# EAGLE design M0plus_breakout (EAGLE 7.7.0)
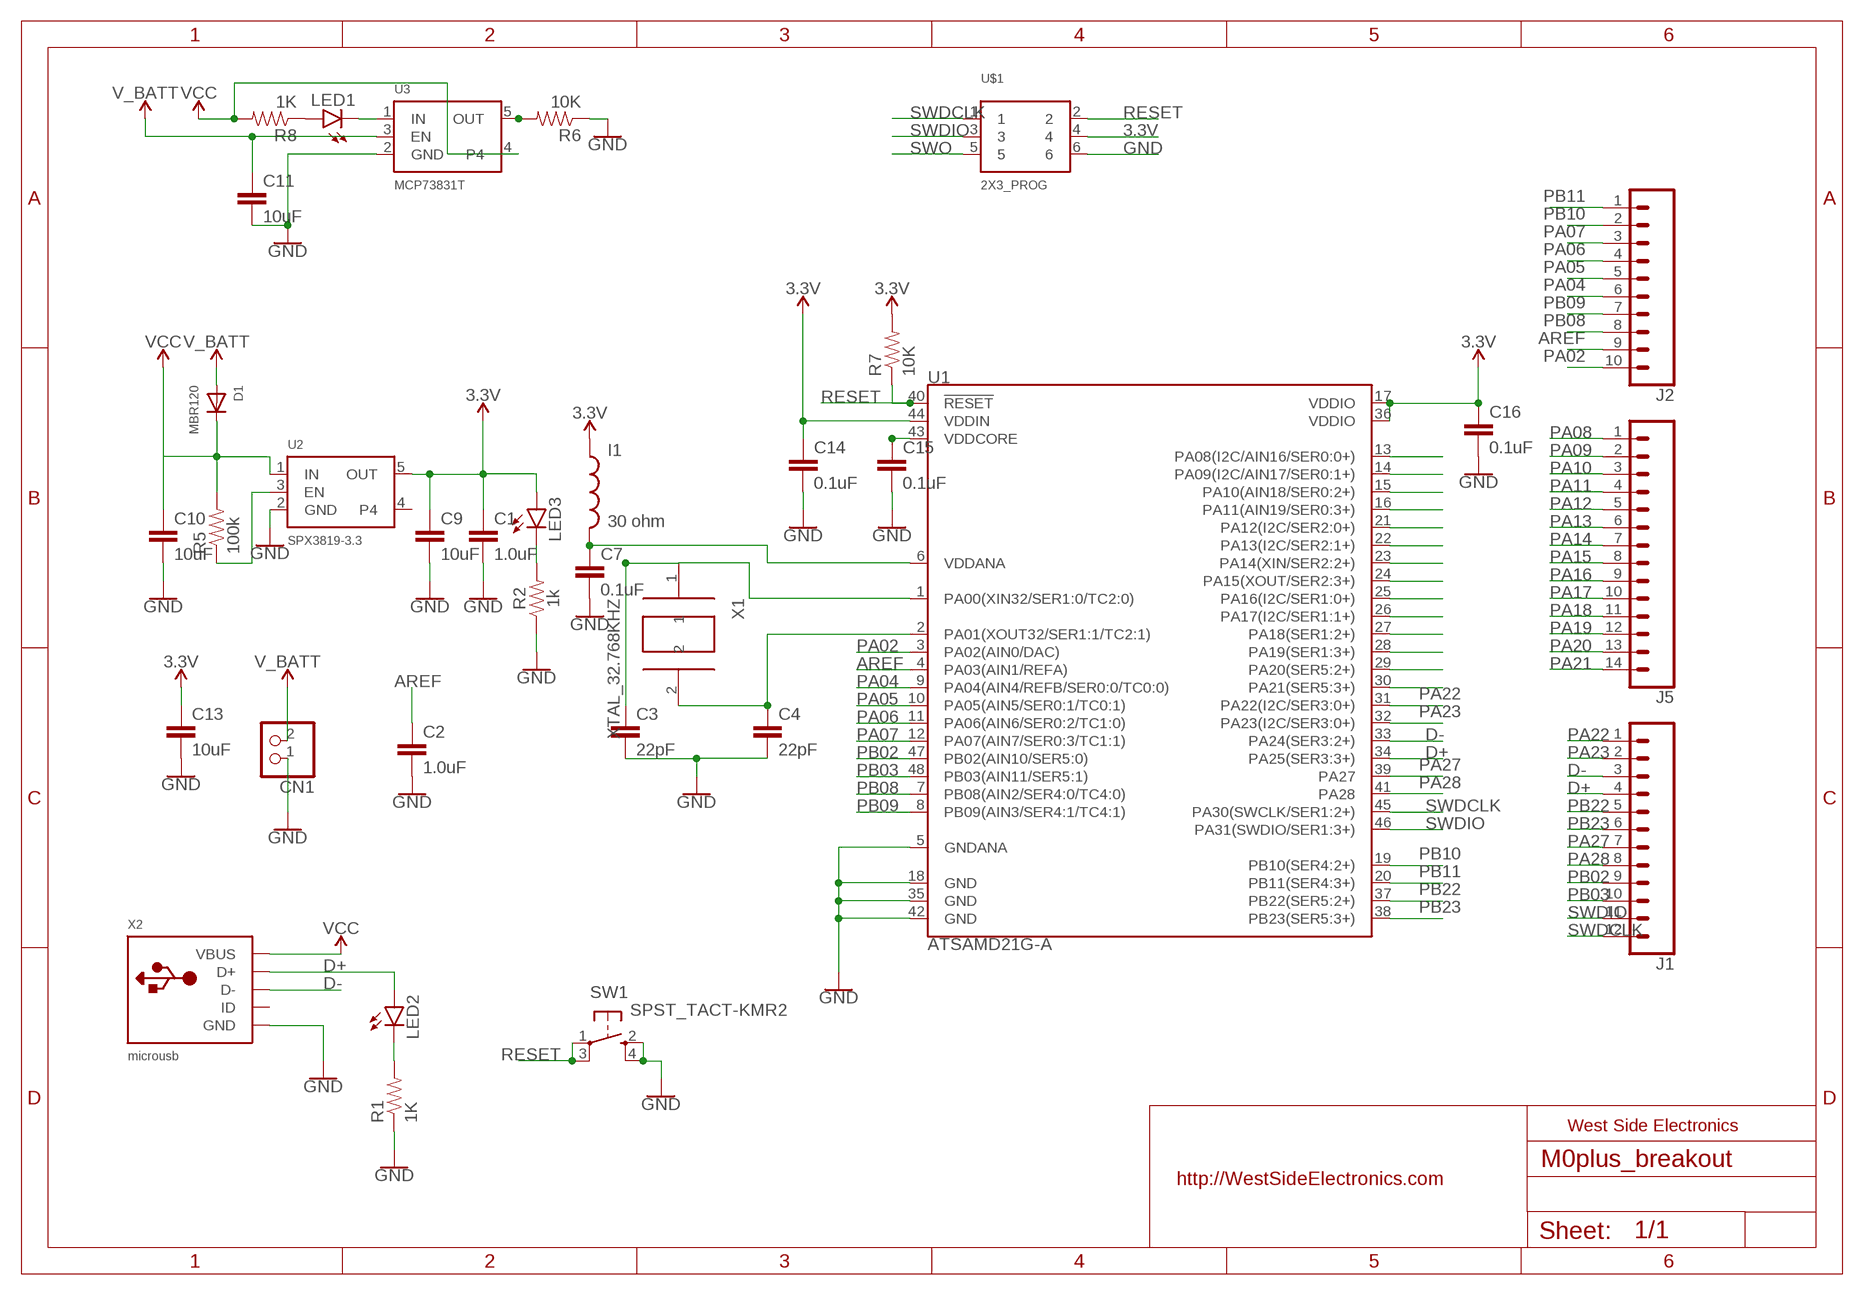
[diagram p0: schematic, sheet 1]

## Parts
C1  1.0uF  1.0UF-16V-10%(0603)  [0603-CAP]
C2  1.0uF  1.0UF-16V-10%(0603)  [0603-CAP]
C3  22pF  22PF-50V-5%(0603)  [0603-CAP]
C4  22pF  22PF-50V-5%(0603)  [0603-CAP]
C7  0.1uF  CAP  [0805]
C9  10uF  CAP  [0805]
C10  10uF  CAP  [0805]
C11  10uF  CAP  [0805]
C13  10uF  CAP  [0805]
C14  0.1uF  0.1UF-25V-5%(0603)  [0603-CAP]
C15  0.1uF  0.1UF-25V-5%(0603)  [0603-CAP]
C16  0.1uF  0.1UF-25V-5%(0603)  [0603-CAP]
CN1  JST_2PIN  [JSTPH2]
D1  MBR120  DIODESOD-123  [SOD-123]
I1  30 ohm  IND  [0805]
J1  CONN_12  [1X12]
J2  CONN_10"  [1X10]
J5  CONN_14  [1X14]
LED1  LED0603  [LED-0603]
LED2  LED0603  [LED-0603]
LED3  LED0603  [LED-0603]
R1  1K  1KOHM-1/10W-1%(0603)  [0603-RES]
R2  1k  1KOHM-0603-1/10W-1%  [0603]
R5  100k  100KOHM-1/10W-1%(0603)  [0603-RES]
R6  10K  10KOHM-1/10W-1%(0603)0603  [0603-RES]
R7  10K  10KOHM-1/10W-1%(0603)0603  [0603-RES]
R8  1K  1KOHM-1/10W-1%(0603)  [0603-RES]
SW1  SPST_TACT-KMR2  [KMR2]
U1  ATSAMD21G-A  [TQFP-48]
U2  SPX3819-3.3  VREG_SOT23-5  [SOT23-5]
U3  MCP73831T  VREG_SOT23-5  [SOT23-5]
U$1  2X3_PROG  [2X3-SMD_PROG]
X1  XTAL_32.768KHZ  [ABS07-32.768KHZ-9-T]
X2  microusb  USB_MICRO_20329_V2  [4UCONN_20329_V2]

## Nets
3.3V: C1.1 C9.1 C13.1 C14.1 C16.1 I1.1 LED3.A R7.2 U1.17(VDDIO) U1.36(VDDIO) U1.44(VDDIN) U2.5(OUT) U$1.4
AREF: C2.1 J2.9 U1.4(PA03(AIN1/REFA))
D+: J1.4 LED2.A U1.34(PA25(SER3:3+)) X2.D+
D-: J1.3 U1.33(PA24(SER3:2+)) X2.D-
GND: C1.2 C2.2 C3.2 C4.2 C7.2 C9.2 C10.2 C11.2 C13.2 C14.2 C15.2 C16.2 CN1.1 R1.1 R2.1 R6.1 SW1.2(S) SW1.4(S1) U1.5(GNDANA) U1.18(GND) U1.35(GND) U1.42(GND) U2.2(GND) U3.2(GND) U$1.6 X2.BASE@1(GND) X2.BASE@2(GND) X2.GND X2.SPRT@1(GND) X2.SPRT@2(GND) X2.SPRT@3(GND) X2.SPRT@4(GND)
N$1: LED1.A R8.1
N$2: C3.1 U1.1(PA00(XIN32/SER1:0/TC2:0)) X1.1
N$3: C4.1 U1.2(PA01(XOUT32/SER1:1/TC2:1)) X1.2
N$4: C15.1 U1.43(VDDCORE)
N$5: LED2.C R1.2
N$6: C7.1 I1.2 U1.6(VDDANA)
N$7: LED3.C R2.2
N$21: R5.1 U2.3(EN)
N$39: LED1.C U3.1(IN)
N$41: R6.2 U3.5(OUT)
PA02: J2.10 U1.3(PA02(AIN0/DAC))
PA04: J2.6 U1.9(PA04(AIN4/REFB/SER0:0/TC0:0))
PA05: J2.5 U1.10(PA05(AIN5/SER0:1/TC0:1))
PA06: J2.4 U1.11(PA06(AIN6/SER0:2/TC1:0))
PA07: J2.3 U1.12(PA07(AIN7/SER0:3/TC1:1))
PA08: J5.1 U1.13(PA08(I2C/AIN16/SER0:0+))
PA09: J5.2 U1.14(PA09(I2C/AIN17/SER0:1+))
PA10: J5.3 U1.15(PA10(AIN18/SER0:2+))
PA11: J5.4 U1.16(PA11(AIN19/SER0:3+))
PA12: J5.5 U1.21(PA12(I2C/SER2:0+))
PA13: J5.6 U1.22(PA13(I2C/SER2:1+))
PA14: J5.7 U1.23(PA14(XIN/SER2:2+))
PA15: J5.8 U1.24(PA15(XOUT/SER2:3+))
PA16: J5.9 U1.25(PA16(I2C/SER1:0+))
PA17: J5.10 U1.26(PA17(I2C/SER1:1+))
PA18: J5.11 U1.27(PA18(SER1:2+))
PA19: J5.12 U1.28(PA19(SER1:3+))
PA20: J5.13 U1.29(PA20(SER5:2+))
PA21: J5.14 U1.30(PA21(SER5:3+))
PA22: J1.1 U1.31(PA22(I2C/SER3:0+))
PA23: J1.2 U1.32(PA23(I2C/SER3:0+))
PA27: J1.7 U1.39(PA27)
PA28: J1.8 U1.41(PA28)
PB02: J1.9 U1.47(PB02(AIN10/SER5:0))
PB03: J1.10 U1.48(PB03(AIN11/SER5:1))
PB08: J2.8 U1.7(PB08(AIN2/SER4:0/TC4:0))
PB09: J2.7 U1.8(PB09(AIN3/SER4:1/TC4:1))
PB10: J2.2 U1.19(PB10(SER4:2+))
PB11: J2.1 U1.20(PB11(SER4:3+))
PB22: J1.5 U1.37(PB22(SER5:2+))
PB23: J1.6 U1.38(PB23(SER5:3+))
RESET: R7.1 SW1.1(P) SW1.3(P1) U1.40(!RESET!) U$1.2
SWDCLK: J1.12 U1.45(PA30(SWCLK/SER1:2+)) U$1.1
SWDIO: J1.11 U1.46(PA31(SWDIO/SER1:3+)) U$1.3
SWO: U$1.5
V_BATT: C11.1 CN1.2 D1.A U3.3(EN)
VCC: C10.1 D1.C R5.2 R8.2 U2.1(IN) U3.4 X2.VBUS
Unconnected: U2.4 X2.ID

## Library data of the parts
C1 C2 = SparkFun-Capacitors:1.0UF-16V-10%(0603): CAP-00868; PROD_ID: CAP-00868
C3 C4 = SparkFun-Capacitors:22PF-50V-5%(0603): CAP-07876; PROD_ID: CAP-07876
C7 C9-C11 C13 = Ilya_Teach:CAP
C14-C16 = SparkFun-Capacitors:0.1UF-25V-5%(0603): CAP-08604; PROD_ID: CAP-08604
CN1 = microbuilder:JST_2PIN: JST 2-Pin Right-Angle Connector PH-Series - 4UConnector: 17311 SH-Series - 4UConnector: 07278
D1 = microbuilder:DIODE: Diode SMA Model Volts Amps Type Vf Vr Digikey # Notes SSA34-E3 40V 3A Schottky 480mV @ 3A 200uA @ 40V SSA34-E3/61TGITR-ND CDBA120-G 20V 1A Schottky 500mV @ 1A 500uA @ 20V 641-1014-6-ND REEL MBRA210 10V 2A Schottky 350mV @ 2A 700uA @ 10V MBRA210LT3 SOD-123 Model Volts Amps Type Vf Vr Order # Notes BAT54T1G 30V 200mA Schottky 800mV @ 200mA 2uA @ 25V BAT54T1GOSTR-ND B0530W 30V 500mA Schottky 430mV @ 500mA 130uA @ 30V B0530W-FDICT-ND REEL MBR120 1A 20V Schottky 340mV @ 1A MBR120VLSFT1GOSCT-ND SOD-323 Model Volts Amps Type Vf Vr Order # Notes PMEG2005EJ 20V 500mA Schottky 355mV @ 500mA 568-4110-1-ND ZLLS410 10V 570mA Schottky 380mV @ 570mA ZLLS410CT-ND 1N4148WS 75V 150mA Silicon/Simple 1V 1N4148WSFSCT-ND REEL SOD-523 Model Volts Amps Type Vf Vr Order # Notes BAT54XV2 30V 200mA Schottky 0.8V @ 100mA BAT54XV2CT-ND TB751S 30V 30mA Schottky RB751S-40TE61CT-ND SOT23-R/W (R = Solder Paste/Reflow Ovens, W = Hand-Soldering) Model Volts Amps Type Vf Vr Order # Notes BAT54FILM 40V 300mA Schottky 497-7162-1-ND
I1 = Ilya_Teach:IND
J1 = SparkFun-Connectors:CONN_12: Multi connection point. Often used as Generic Header-pin footprint for 0.1 inch spaced/style header connections On any of the 0.1 inch spaced packages, you can populate with these: Break Away Headers - Straight <https://www.sparkfun.com/products/116> (PRT-00116) Break Away Male Headers - Right Angle <https://www.sparkfun.com/products/553> (PRT-00553) Female Headers <https://www.sparkfun.com/products/115> (PRT-00115) Break Away Headers - Machine Pin <https://www.sparkfun.com/products/117> (PRT-00117) Break Away Female Headers - Swiss Machine Pin <https://www.sparkfun.com/products/743> (PRT-00743) For SCREWTERMINALS and SPRING TERMINALS visit here: Screw Terimnals on SparkFun.com <https://www.sparkfun.com/search/results?term=Screw+Terminals> (5mm/3.5mm/2.54mm spacing) This device is also useful as a general connection point to wire up your design to another part of your project. Our various solder wires solder well into these plated through hole pads. Hook-Up Wire - Assortment (Stranded, 22 AWG) <https://www.sparkfun.com/products/11375> (PRT-11375) Hook-Up Wire - Assortment (Solid Core, 22 AWG) <https://www.sparkfun.com/products/11367> (PRT-11367) View the entire wire category on our website here <https://www.sparkfun.com/categories/141> Special notes: Molex polarized connector foot print use with SKU : PRT-08231 with associated crimp pins and housings. 1MM SMD Version SKU: PRT-10208 NOTES ON THE VARIANTS LOCK and LOCK_LONGPADS... This footprint was designed to help hold the alignment of a through-hole component (i.e. 6-pin header) while soldering it into place. You may notice that each hole has been shifted either up or down by 0.005 of an inch from it's more standard position (which is a perfectly straight line). This slight alteration caused the pins (the squares in the middle) to touch the edges of the holes. Because they are alternating, it causes a "brace" to hold the component in place. 0.005 has proven to be the perfect amount of "off-center" position when using our standard breakaway headers. Although looks a little odd when you look at the bare footprint, once you have a header in there, the alteration is very hard to notice. Also,if you push a header all the way into place, it is covered up entirely on the bottom side.
J2 = SparkFun-Connectors:CONN_10: Multi connection point. Often used as Generic Header-pin footprint for 0.1 inch spaced/style header connections On any of the 0.1 inch spaced packages, you can populate with these: Break Away Headers - Straight <https://www.sparkfun.com/products/116> (PRT-00116) Break Away Male Headers - Right Angle <https://www.sparkfun.com/products/553> (PRT-00553) Female Headers <https://www.sparkfun.com/products/115> (PRT-00115) Break Away Headers - Machine Pin <https://www.sparkfun.com/products/117> (PRT-00117) Break Away Female Headers - Swiss Machine Pin <https://www.sparkfun.com/products/743> (PRT-00743) Arduino Stackable Header - 10 Pin <https://www.sparkfun.com/products/11376> (PRT-11376) For SCREWTERMINALS and SPRING TERMINALS visit here: Screw Terimnals on SparkFun.com <https://www.sparkfun.com/search/results?term=Screw+Terminals> (5mm/3.5mm/2.54mm spacing) This device is also useful as a general connection point to wire up your design to another part of your project. Our various solder wires solder well into these plated through hole pads. Hook-Up Wire - Assortment (Stranded, 22 AWG) <https://www.sparkfun.com/products/11375> (PRT-11375) Hook-Up Wire - Assortment (Solid Core, 22 AWG) <https://www.sparkfun.com/products/11367> (PRT-11367) View the entire wire category on our website here <https://www.sparkfun.com/categories/141> Special notes: Molex polarized connector foot print use with SKU : PRT-08231 with associated crimp pins and housings. 1MM SMD Version SKU: PRT-10208 NOTES ON THE VARIANTS LOCK and LOCK_LONGPADS... This footprint was designed to help hold the alignment of a through-hole component (i.e. 6-pin header) while soldering it into place. You may notice that each hole has been shifted either up or down by 0.005 of an inch from it's more standard position (which is a perfectly straight line). This slight alteration caused the pins (the squares in the middle) to touch the edges of the holes. Because they are alternating, it causes a "brace" to hold the component in place. 0.005 has proven to be the perfect amount of "off-center" position when using our standard breakaway headers. Although looks a little odd when you look at the bare footprint, once you have a header in there, the alteration is very hard to notice. Also,if you push a header all the way into place, it is covered up entirely on the bottom side.; PROD_ID: CONN-11563
J5 = SparkFun-Connectors:CONN_14: Multi connection point. Often used as Generic Header-pin footprint for 0.1 inch spaced/style header connections On any of the 0.1 inch spaced packages, you can populate with these: Break Away Headers - Straight <https://www.sparkfun.com/products/116> (PRT-00116) Break Away Male Headers - Right Angle <https://www.sparkfun.com/products/553> (PRT-00553) Female Headers <https://www.sparkfun.com/products/115> (PRT-00115) Break Away Headers - Machine Pin <https://www.sparkfun.com/products/117> (PRT-00117) Break Away Female Headers - Swiss Machine Pin <https://www.sparkfun.com/products/743> (PRT-00743) For SCREWTERMINALS and SPRING TERMINALS visit here: Screw Terimnals on SparkFun.com <https://www.sparkfun.com/search/results?term=Screw+Terminals> (5mm/3.5mm/2.54mm spacing) This device is also useful as a general connection point to wire up your design to another part of your project. Our various solder wires solder well into these plated through hole pads. Hook-Up Wire - Assortment (Stranded, 22 AWG) <https://www.sparkfun.com/products/11375> (PRT-11375) Hook-Up Wire - Assortment (Solid Core, 22 AWG) <https://www.sparkfun.com/products/11367> (PRT-11367) View the entire wire category on our website here <https://www.sparkfun.com/categories/141> Special notes: Molex polarized connector foot print use with SKU : PRT-08231 with associated crimp pins and housings. 1MM SMD Version SKU: PRT-10208 NOTES ON THE VARIANTS LOCK and LOCK_LONGPADS... This footprint was designed to help hold the alignment of a through-hole component (i.e. 6-pin header) while soldering it into place. You may notice that each hole has been shifted either up or down by 0.005 of an inch from it's more standard position (which is a perfectly straight line). This slight alteration caused the pins (the squares in the middle) to touch the edges of the holes. Because they are alternating, it causes a "brace" to hold the component in place. 0.005 has proven to be the perfect amount of "off-center" position when using our standard breakaway headers. Although looks a little odd when you look at the bare footprint, once you have a header in there, the alteration is very hard to notice. Also,if you push a header all the way into place, it is covered up entirely on the bottom side.
LED1-LED3 = Ilya_Teach:LED: LEDs Standard schematic elements and footprints for 5mm, 3mm, 1206, and 0603 sized LEDs. 5mm - Spark Fun Electronics SKU : COM-00529 (and others)
R1 R8 = SparkFun-Resistors:1KOHM-1/10W-1%(0603): RES-07856; PROD_ID: RES-07856
R2 = SparkFun-Resistors:1KOHM: 1kΩ resistor A resistor is a passive two-terminal electrical component that implements electrical resistance as a circuit element. Resistors act to reduce current flow, and, at the same time, act to lower voltage levels within circuits. - Wikipedia; PROD_ID: RES-07856
R5 = SparkFun-Resistors:100KOHM-1/10W-1%(0603): RES-07828; PROD_ID: RES-07828
R6 R7 = SparkFun-Resistors:10KOHM-1/10W-1%(0603): RES-00824; PROD_ID: RES-00824
SW1 = adafruit:SPST_TACT: SMT 6mm switch, EVQQ2 series http://www.ladyada.net/library/eagle
U1 = SparkFun-IC-Microcontroller:ATSAMD21G: Atmel SAMD21G SMART ARM-Based Microcontroller The Atmel ® | SMART ™ SAM D21 is a series of low-power microcontrollers using the 32-bit ARM ® Cortex ® -M0+ processor, and ranging from 32- to 64-pins with up to 256KB Flash and 32KB of SRAM. The SAM D21 devices operate at a maximum frequency of 48MHz and reach 2.46 CoreMark/MHz. They are designed for simple and intuitive migration with identical peripheral modules, hex compatible code, identical linear address map and pin compatible migration paths between all devices in the product series. All devices include intelligent and flexible peripherals, Atmel Event System for inter-peripheral signaling, and support for capacitive touch button, slider and wheel user interfaces. Datasheet <https://cdn.sparkfun.com/datasheets/Dev/Arduino/Boards/Atmel-42181-SAM-D21_Datasheet.pdf> SparkFun Products SparkFun SAMD21 Mini Breakout <https://www.sparkfun.com/products/13664> (DEV-13664) SparkFun SAMD21 Dev Breakout <https://www.sparkfun.com/products/13672> (DEV-13672); PROD_ID: IC-13064
U2 U3 = microbuilder:VREG_SOT23-5: SOT23-5 Fixed Voltage Regulators To better organise some of the SOT23-5 fixed voltage regulators in this library, this new part was created. Part Current Out V Out V In V Dropout Digikey Part No. ADP121 150mA 3.3V 3.4-5.5V 0.09V @ 150mA ADP121-AUJZ33R7CT-ND ADP121 150mA 3.0V 3.1-5.5V 0.09V @ 150mA ADP121-AUJZ30R7CT-ND ADP122 300mA 3.3V 3.4-5.5V 0.085V @ 300mA ADP122AUJZ-3.3-R7CT-ND ADP1712 300mA 3.3V 3.5-5.5V 0.17V @ 300mA ADP1712AUJZ-3.3-R7TR-ND AP7311 (Low Cost) 150mA 3.3V 3.5-6V 0.15V @ 150mA AP7311-33WG-7DICT-ND LD39015M18R 150mA 1.8V 1.9V-5.5V 0.08V @ 100mA 497-6977-1-ND MCP1824T-3302E/OT 300mA 3.3V 3.5V-6V 0.2V @ 300mA MCP1824T-3302E/OTCT-ND MIC5205-2.5YM5 TR 150mA 2.5V 2.7-16V 0.165V @ 150mA 576-1257-2-ND MIC5205-3.0YM5 TR 150mA 3.0V 3.2V-16V 0.165V @ 150mA 576-1258-2-ND MIC5205-3.3YM5 TR 150mA 3.3V 3.5V-16V 0.165V @ 150mA 576-1259-2-ND TPS780330220 150mA 3.3V+2.2V 3.6-5.5V 250mV Max 296-23332-1-ND TDA3663/N1,135 100mA 3.3V 3.5-45V 0.18V @ 50mA 568-5343-1-ND
U$1 = Ilya_Teach:2X3_PROG
X1 = Ilya_Teach:XTAL_32.768KHZ
X2 = microbuilder:USB: USB Connectors USBMINIB - Surface Mount Female Mini-B USB Connector 4UConnector: 06564

## Board
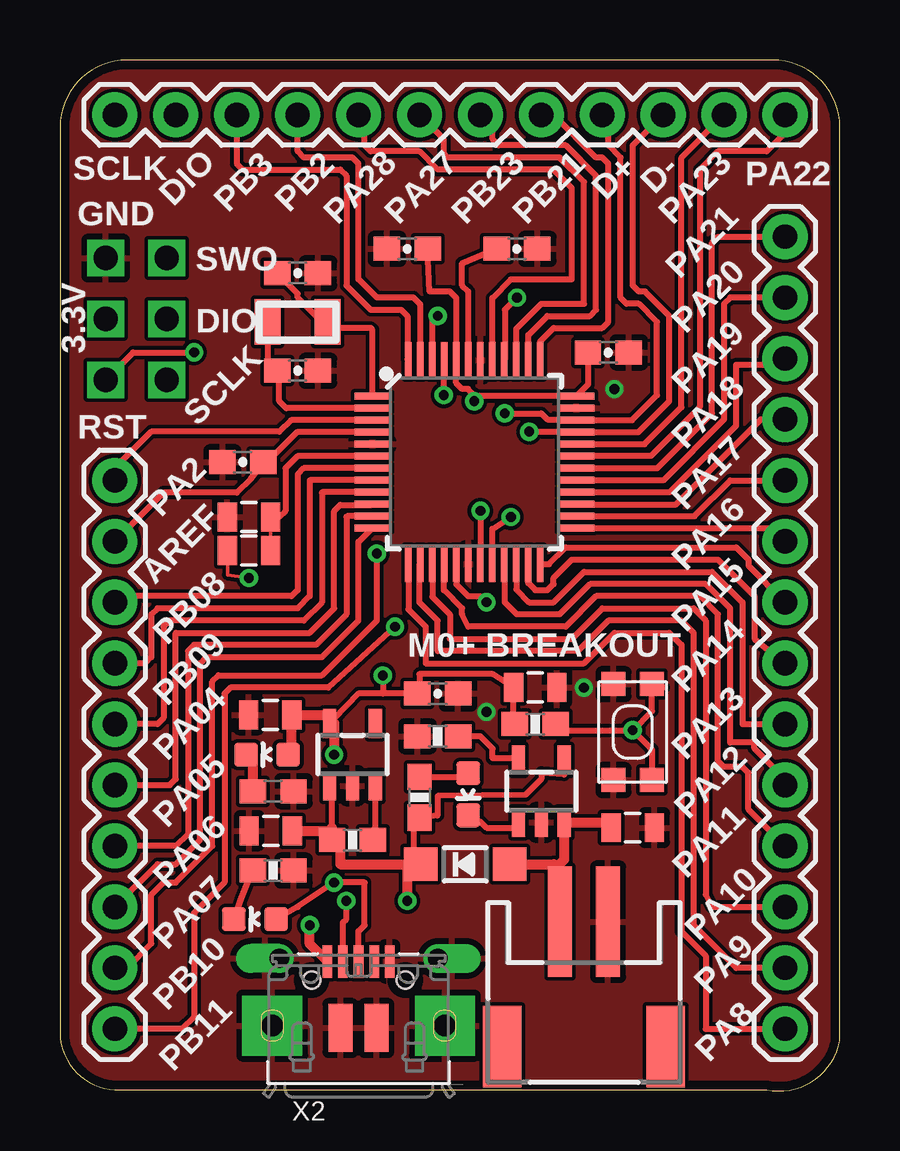
[diagram p1: board, top side]
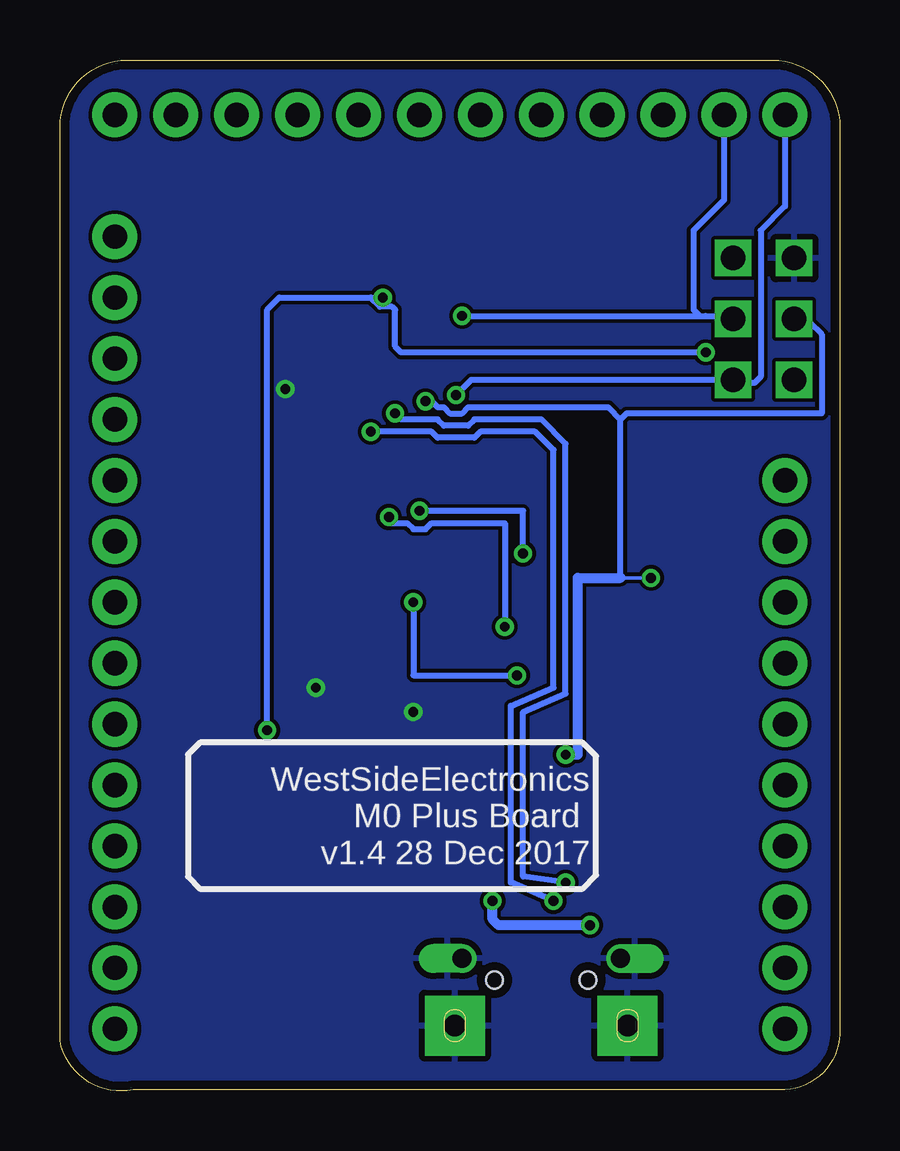
[diagram p2: board, bottom side, seen from below]

Size 32.51 x 42.98 mm. Coordinates in mm from the lower left corner, seen from the top.
Outline: 29.72,42.98 2.8,42.98 arc90 0,40.18 0,2.59 arc90 2.29,0.05 29.47,0.05 arc90 32.51,2.08 32.51,40.18 arc90 29.72,42.98
Copper layers (1*16): Top 0.0356mm / dielectric 1.5011mm / Bottom 0.0356mm
Design rules "LaenPCBOrder *": minimum track width 6mil, minimum drill 13mil, track to track 6mil, track to pad 6mil, pad to pad 6mil, via to via 6mil, smd to smd 6mil, copper to edge 15mil, drill to drill 6mil, minimum pad ring 7mil, minimum via ring 7mil, stop-mask expansion 3mil, vias tented up to drill 30mil, thermal gap 10mil

### Footprints (pad centres in the part's own frame; a part is rotated, then mirrored left to right if it is on the bottom)
0603-CAP = smd 1.1 x 1: 1 -0.85,0; 2 0.85,0
0805 = smd 0.8 x 1.2: 1 -0.9,0; 2 0.9,0
JSTPH2 = smd 1 x 4.6: 1 -1,-3.7; 2 1,-3.7 | smd 1.6 x 3.4: NC1 -3.4,1.5; NC2 3.4,1.5
SOD-123 = smd 1.4 x 1.4: A 1.85,0; C -1.85,0
1X12 = drill 1.016 pad 1.88: 1 0,0; 2 2.54,0; 3 5.08,0; 4 7.62,0; 5 10.16,0; 6 12.7,0; 7 15.24,0; 8 17.78,0; 9 20.32,0; 10 22.86,0; 11 25.4,0; 12 27.94,0
1X10 = drill 1.016 pad 1.88: 1 0,0; 2 2.54,0; 3 5.08,0; 4 7.62,0; 5 10.16,0; 6 12.7,0; 7 15.24,0; 8 17.78,0; 9 20.32,0; 10 22.86,0
1X14 = drill 1.016 pad 1.88: 1 0,0; 2 2.54,0; 3 5.08,0; 4 7.62,0; 5 10.16,0; 6 12.7,0; 7 15.24,0; 8 17.78,0; 9 20.32,0; 10 22.86,0; 11 25.4,0; 12 27.94,0; 13 30.48,0; 14 33.02,0
LED-0603 = smd 1 x 1: A 0,-0.877; C 0,0.877
0603-RES = smd 1.1 x 1: 1 -0.85,0; 2 0.85,0
0603 = smd 1.1 x 1: 1 -0.85,0; 2 0.85,0
KMR2 = smd 1 x 1: 1 2,0.8; 2 2,-0.8; 3 -2,0.8; 4 -2,-0.8
TQFP-48 = smd 1.5 x 0.28: 1 -4.25,2.75; 2 -4.25,2.25; 3 -4.25,1.75; 4 -4.25,1.25; 5 -4.25,0.75; 6 -4.25,0.25; 7 -4.25,-0.25; 8 -4.25,-0.75; 9 -4.25,-1.25; 10 -4.25,-1.75; 11 -4.25,-2.25; 12 -4.25,-2.75; 25 4.25,-2.75; 26 4.25,-2.25; 27 4.25,-1.75; 28 4.25,-1.25; 29 4.25,-0.75; 30 4.25,-0.25; 31 4.25,0.25; 32 4.25,0.75; 33 4.25,1.25; 34 4.25,1.75; 35 4.25,2.25; 36 4.25,2.75 | smd 0.28 x 1.5: 13 -2.75,-4.25; 14 -2.25,-4.25; 15 -1.75,-4.25; 16 -1.25,-4.25; 17 -0.75,-4.25; 18 -0.25,-4.25; 19 0.25,-4.25; 20 0.75,-4.25; 21 1.25,-4.25; 22 1.75,-4.25; 23 2.25,-4.25; 24 2.75,-4.25; 37 2.75,4.25; 38 2.25,4.25; 39 1.75,4.25; 40 1.25,4.25; 41 0.75,4.25; 42 0.25,4.25; 43 -0.25,4.25; 44 -0.75,4.25; 45 -1.25,4.25; 46 -1.75,4.25; 47 -2.25,4.25; 48 -2.75,4.25
SOT23-5 = smd 0.55 x 1.2: 1 -0.95,-1.3; 2 0,-1.3; 3 0.95,-1.3; 4 0.95,1.3; 5 -0.95,1.3
2X3-SMD_PROG = drill 1.016 pad 1.27 square: 1 -1.27,-1.27; 2 -1.27,1.27; 3 1.27,-1.27; 4 1.27,1.27; 5 3.81,-1.27; 6 3.81,1.27
ABS07-32.768KHZ-9-T = smd 1.1 x 1.9: 1 -1.25,0; 2 1.25,0
4UCONN_20329_V2 = smd 1 x 2: BASE@1 -0.75,-2; BASE@2 0.75,-2 | smd 0.4 x 1.35: D+ 0,0.775; D- -0.65,0.775; GND 1.3,0.775; ID 0.65,0.775; VBUS -1.3,0.775 | drill 0.8 pad 1.2 offset: SPRT@1 -3.3,0.9; SPRT@2 3.3,0.9 | drill 0.9 pad 2.5 square: SPRT@3 -3.6,-1.9; SPRT@4 3.6,-1.9 | hole 0.7: -1.95,0; 1.95,0

### Placement (x,y rotation side)
C1  15.75,16.56 0 top
C2  7.62,26.21 180 top
C3  9.91,34.09 0 top
C4  9.91,30.02 0 top
C7  7.88,23.93 180 top
C9  8.76,15.67 180 top
C10  8.79,10.85 180 top
C11  23.88,10.97 0 top
C13  19.81,16.81 0 top
C14  14.48,35.1 180 top
C15  19.05,35.1 0 top
C16  22.86,30.78 0 top
CN1  21.85,3.35 180 top
D1  16.89,9.45 0 top
I1  7.88,22.53 0 top
J1  30.23,40.69 180 top
J2  2.29,2.59 90 top
J5  30.23,2.59 90 top
LED1  17.02,12.37 180 top
LED2  8.13,7.16 90 top
LED3  8.64,14.02 90 top
R1  8.89,9.19 180 top
R2  8.89,12.5 180 top
R5  12.19,10.46 180 top
R6  15.75,14.78 0 top
R7  19.81,15.29 180 top
R8  14.99,12.24 270 top
SW1  23.88,14.96 270 top
U1  17.27,26.21 0 top
U2  12.19,14.02 0 top
U3  20.07,12.5 0 top
U$1  3.18,30.91 90 top
X1  9.91,32.05 180 top
X2  12.45,4.62 0 top

### Tracks (layer width: path | path; a pad name or v marks a point on that pad's centre or on a via)
3.3V  (via drill 0.41)
  Top 0.152: I1.1 6.99,21.51 v7.88,21.39
  Top 0.254: C16.1 22.01,29.45 U1.36 17.48,28.96 | C14.1 15.41,33.32 16.26,33.32 16.52,33.06 U1.44 16.51,30.45 16.51,29.51 16.77,29.26 17.02,29.26 17.32,28.96 17.48,28.96 | 13.46,16.56 C1.1 14.99,16.9 14.99,17.37 18.04,17.37 C13.1 18.91,15.34 R7.2 | 13.46,16.56 12.45,16.56 11.43,15.51 U2.5 | U1.17 16.52,21.12 17.02,20.62 17.53,20.62 v17.78,20.37 | v13.46,17.32 13.46,16.56 | 17.48,28.96 v17.27,28.75
  Top 0.406: v11.43,14.02 11.43,15.32 U2.5 11.24,15.67 C9.1 9.66,14.02 LED3.A
  Bottom 0.152: v7.88,21.39 9.15,21.39
  Bottom 0.254: 9.15,21.39 9.15,27.99 | 9.15,27.99 8.89,28.24 0.76,28.24 0.76,31.55 1.27,32.05 2.03,32.05 U$1.4 | v17.78,20.37 17.78,17.32 v13.46,17.32 | v17.27,28.75 17.02,28.75 16.77,28.5 16.51,28.5 16.26,28.24 15.75,28.24 15.5,28.5 9.65,28.5 9.15,27.99
  Bottom 0.406: v11.43,14.02 10.92,14.02 10.92,21.39 9.15,21.39
AREF
  Top 0.254: U1.4 13,27.48 9.91,27.48 8.64,26.21 C2.1 7.96,25.54 7.37,24.94 4.32,24.94 J2.9
D+  (via drill 0.41)
  Top 0.254: J1.4 22.86,40.44 22.86,39.42 23.37,38.91 23.37,33.07 23.62,32.82 24.13,32.82 24.89,32.05 24.89,29.01 23.85,27.96 U1.34 21.5,27.99 20.32,27.99 20.07,28.24 v18.54,28.24 | X2.D+ 12.45,6.65 12.7,6.91 12.7,8.69 v11.43,8.69 9.91,7.67 LED2.A
  Bottom 0.254: v11.43,8.69 13.21,8.94 13.21,15.8 11.43,16.56 11.43,26.97 12.45,27.99 15.24,27.99 15.5,27.74 16.51,27.74 16.77,27.99 18.29,27.99 v18.54,28.24
D-  (via drill 0.41)
  Top 0.254: J1.3 23.88,39.42 23.88,33.58 24.13,33.32 24.39,33.32 25.4,32.31 25.4,28.75 24.11,27.46 U1.33 19.58,27.46 arc-90 v19.56,27.48 | X2.D- 11.8,7.02 11.94,7.16 v11.94,7.92
  Bottom 0.254: v19.56,27.48 17.02,27.48 16.77,27.23 15.24,27.23 14.99,27.48 12.7,27.48 11.94,26.72 11.94,16.81 13.72,16.05 13.72,8.69 v11.94,7.92
GND  (via drill 0.41)
  other vias: 23.12,29.26 21.85,16.81 17.78,15.8
  pour Top: -0.25,48.31 48.01,48.31 48.01,0.05 -0.25,0.05 -0.25,47.04
  pour Bottom: -0.25,48.31 48.01,48.31 48.01,0.05 -0.25,0.05
N$1
  Top 0.254: R8.1 17.37,13.09 LED1.A
N$2
  Top 0.254: U1.1 13.02,31.73 12.96,31.8 11.41,31.8 X1.1 10.92,32.05 9.91,33.07 9.91,33.24 C3.1
N$3
  Top 0.254: X1.2 8.66,30.42 C4.1 9.15,29.93 9.15,28.75 9.44,28.46 U1.2
N$4
  Top 0.254: U1.43 17.02,33.32 16.77,33.58 16.77,34.51 C15.1
N$5
  Top 0.254: LED2.C 7.53,7.95 R1.2
N$6
  Top 0.152: I1.2 C7.1
  Top 0.254: U1.6 9.9,26.46 9.4,25.96 9.4,24.18 9.15,23.93 C7.1
N$7
  Top 0.406: LED3.C 8.04,14.02 R2.2
N$21
  Top 0.254: U2.3 13.14,11.07 R5.1
N$39
  Top 0.152: 19.12,10.92 U3.1
  Top 0.254: LED1.C 17.53,11.23 17.78,10.97 19.07,10.97 19.12,10.92
N$41
  Top 0.254: U3.5 19.05,13.86 18.04,13.86 18.04,14.27 17.53,14.78 R6.2
PA02
  Top 0.254: U1.3 9.63,27.96 9.15,27.48 3.81,27.48 2.29,25.96 J2.10
PA04
  Top 0.254: U1.9 10.94,24.96 10.92,24.94 10.92,20.37 10.16,19.61 4.57,19.61 4.32,19.35 4.32,15.54 4.07,15.29 J2.6
PA05
  Top 0.254: J2.5 4.57,12.75 4.83,13 4.83,19.1 10.42,19.1 11.43,20.12 11.43,24.18 11.69,24.43 13,24.43 U1.10
PA06
  Top 0.254: U1.11 11.98,23.96 11.94,23.93 11.94,19.86 10.67,18.59 5.59,18.59 5.34,18.34 5.34,10.72 4.83,10.21 J2.4
PA07
  Top 0.152: 13.46,23.46 U1.12
  Top 0.254: J2.3 4.07,9.45 4.83,9.45 5.84,10.46 5.84,17.83 6.1,18.08 10.92,18.08 12.45,19.61 12.45,22.89 U1.12
PA08
  Top 0.254: U1.13 14.52,20.07 15.24,19.35 15.24,17.83 21.85,17.83 23.12,19.1 25.4,19.1 25.91,18.59 25.91,6.65 26.93,5.64 26.93,2.59 J5.1
PA09
  Top 0.254: J5.2 28.2,5.13 26.42,6.91 26.42,19.1 25.91,19.61 22.86,19.61 21.59,18.34 15.75,18.34 15.75,19.61 14.99,20.37 14.99,21.93 U1.14
PA10
  Top 0.254: U1.15 15.52,20.6 16.26,19.86 16.26,18.85 21.34,18.85 22.61,20.12 26.42,20.12 26.93,19.61 26.93,8.18 27.18,7.67 J5.3
PA11
  Top 0.152: U1.16 arc90 16,21.94
  Top 0.254: J5.4 28.7,11.73 28.7,13.26 28.45,13.51 27.69,13.51 27.43,13.77 27.43,19.86 26.67,20.62 22.35,20.62 21.08,19.35 17.02,19.35 16.77,19.86 16.77,20.12 16,20.88 16,21.94 U1.16
PA12
  Top 0.254: J5.5 30.23,13 28.96,14.27 28.96,14.53 27.94,14.53 27.94,20.12 26.93,21.13 22.1,21.13 20.83,19.86 19.05,19.86 18.54,20.37 18.54,21.94 U1.21
PA13
  Top 0.254: U1.22 19.02,20.91 19.56,20.37 20.58,20.37 21.85,21.64 27.18,21.64 28.45,20.37 28.45,15.29 J5.6
PA14
  Top 0.254: U1.23 19.52,21.17 19.81,20.88 20.32,20.88 20.58,21.13 20.58,21.39 21.34,22.15 27.43,22.15 28.96,20.62 28.96,18.85 J5.7
PA15
  Top 0.254: U1.24 20.39,21.96 21.08,22.66 28.2,22.66 28.7,22.15 28.7,21.89 J5.8
PA16
  Top 0.254: U1.25 29.68,23.46 J5.9
PA17
  Top 0.254: U1.26 26.45,23.96 27.94,25.45 J5.10
PA18
  Top 0.254: J5.11 29.21,27.99 25.66,24.43 21.55,24.43 U1.27
PA19
  Top 0.254: U1.28 25.42,24.96 28.2,27.74 28.2,30.28 29.97,30.28 J5.12
PA20
  Top 0.254: J5.13 27.94,33.07 27.69,32.82 27.69,27.99 25.15,25.45 U1.29
PA21
  Top 0.254: U1.30 24.9,25.96 27.18,28.24 27.18,35.36 27.43,35.61 J5.14
PA22
  Top 0.254: J1.1 30.23,39.93 29.47,39.17 27.43,39.17 26.67,38.4 26.67,28.5 24.64,26.47 U1.31
PA23
  Top 0.254: U1.32 24.37,26.96 25.91,28.5 25.91,38.91 J1.2
PA27
  Top 0.254: U1.39 19.02,31.77 20.07,32.82 21.85,32.82 21.85,37.9 20.83,38.91 16.16,38.91 16,39.06 16,39.67 J1.7
PA28
  Top 0.254: U1.41 18.02,33.06 18.8,33.83 21.34,33.83 21.34,37.64 20.58,38.4 15.75,38.4 14.99,39.17 12.96,39.17 12.7,39.42 12.7,40.44 J1.8
PB02
  Top 0.254: U1.47 15.02,32.78 14.73,33.07 13.21,33.07 12.45,33.83 12.45,38.66 12.19,38.91 10.16,38.91 9.91,39.17 J1.9
PB03
  Top 0.254: J1.10 7.37,38.66 7.62,38.4 11.69,38.4 11.94,38.15 11.94,33.58 12.96,32.56 14.23,32.56 14.48,32.31 14.48,30.51 U1.48
PB08
  Top 0.254: U1.7 10.17,25.96 9.91,25.7 9.91,20.88 9.65,20.62 2.54,20.62 J2.8
PB09
  Top 0.254: U1.8 10.43,25.46 10.42,25.45 10.42,20.62 9.91,20.12 4.07,20.12 3.81,19.86 3.81,18.08 3.56,17.83 J2.7
PB10  (via drill 0.41)
  Top 0.254: J2.2 2.8,5.13 3.81,6.15 3.81,8.18 4.32,8.69 4.83,8.69 6.35,10.21 6.35,17.07 6.61,17.32 10.92,17.32 13.21,19.61 v13.21,22.4 | v17.53,24.18 U1.19
  Bottom 0.254: v13.21,22.4 13.21,24.18 v17.53,24.18
PB11  (via drill 0.41)
  Top 0.254: U1.20 18.02,23.43 v18.8,23.93 | v13.97,19.35 11.18,16.81 7.11,16.81 6.86,16.56 6.86,8.69 5.59,7.42 5.59,3.1 5.08,2.59 J2.1
  Bottom 0.254: v18.8,23.93 18.8,23.67 18.04,23.67 17.78,23.42 17.27,23.42 17.02,23.67 13.97,23.67 v13.97,19.35
PB22
  Top 0.254: U1.37 20.02,31.25 20.58,31.8 22.61,31.8 22.86,32.05 22.86,38.66 22.61,38.91 22.35,38.91 20.58,40.69 J1.5
PB23
  Top 0.254: U1.38 19.52,31.51 20.32,32.31 22.1,32.31 22.35,32.56 22.35,38.15 21.08,39.42 18.29,39.42 18.04,39.67 18.04,40.18 J1.6
RESET  (via drill 0.41)
  Top 0.254: 25.15,16.81 25.11,16.85 SW1.3 24.68,15.84 v23.88,15.04 | v19.05,33.07 18.54,32.56 18.54,30.48 U1.40 | U$1.2 3.05,30.78 v5.59,30.78 | R7.1 20.92,15.04 v23.88,15.04 | v23.88,15.04 24.68,14.24 SW1.1
  Bottom 0.254: v23.88,15.04 23.88,32.56 23.37,33.07 19.56,33.07 | 19.56,33.07 v19.05,33.07 | v5.59,30.78 18.29,30.78 18.54,31.04 18.54,32.56 18.67,32.69 19.18,32.69 19.56,33.07
SWDCLK  (via drill 0.41)
  Top 0.254: v16,29.01 16,30.44 U1.45
  Bottom 0.254: J1.12 2.29,36.88 3.3,35.86 3.3,29.77 3.56,29.51 4.32,29.51 U$1.1 15.37,29.64 v16,29.01
SWDIO  (via drill 0.41)
  Top 0.254: U1.46 15.52,32.08 v15.75,32.31
  Bottom 0.254: J1.11 4.83,37.13 6.1,35.86 6.1,32.56 5.84,32.31 | 5.84,32.31 5.59,32.31 4.57,32.31 U$1.3 | v15.75,32.31 5.84,32.31
V_BATT
  Top 0.406: D1.A 20.58,9.45 20.7,9.32 | 20.7,9.32 20.83,9.19 20.83,7.07 CN1.2 | 20.7,9.32 21.02,9.64 U3.3 22.75,11.2 C11.1
VCC  (via drill 0.41)
  Top 0.254: U3.4 21.02,13.19 20.07,13.26 20.07,13 19.41,12.34 15.75,12.29 15.74,11.48 R8.2 15.15,11.65 14.73,11.23 14.73,9.76 D1.C | U2.1 11.34,12.62 11.34,10.97 R5.2 11.43,10.63
  Top 0.406: 11.43,10.63 11.69,10.38 11.69,9.45 14.48,9.45 | 14.48,9.45 D1.C | X2.VBUS 10.42,6.13 v10.42,6.91 | v14.48,7.92 14.48,9.45 | C10.1 11.34,10.85 11.34,10.97
  Bottom 0.406: v10.42,6.91 14.23,6.91 14.48,7.16 v14.48,7.92

### Text on the board
tPlace: SCLK | PA22 | DIO | PB3 | PB2 | D+ | D- | GND | PA28 | PA27 | PB23 | PB21 | PA23 | SWO | PA21 | DIO | PA20 | 3.3V | PA19 | SCLK | RST | PA18 | PA2 | PA17 | PA16 | AREF | PB08 | PA15 | M0+ BREAKOUT | PA14 | PB09 | PA04 | PA13 | PA05 | PA12 | PA11 | PA06 | PA07 | PA10 | PA9 | PB10 | PB11 | PA8
bPlace: WestSideElectronics / M0 Plus Board / v1.4 28 Dec 2017